# Altium schematic sheet BombasConMUX.SchDoc
size A4
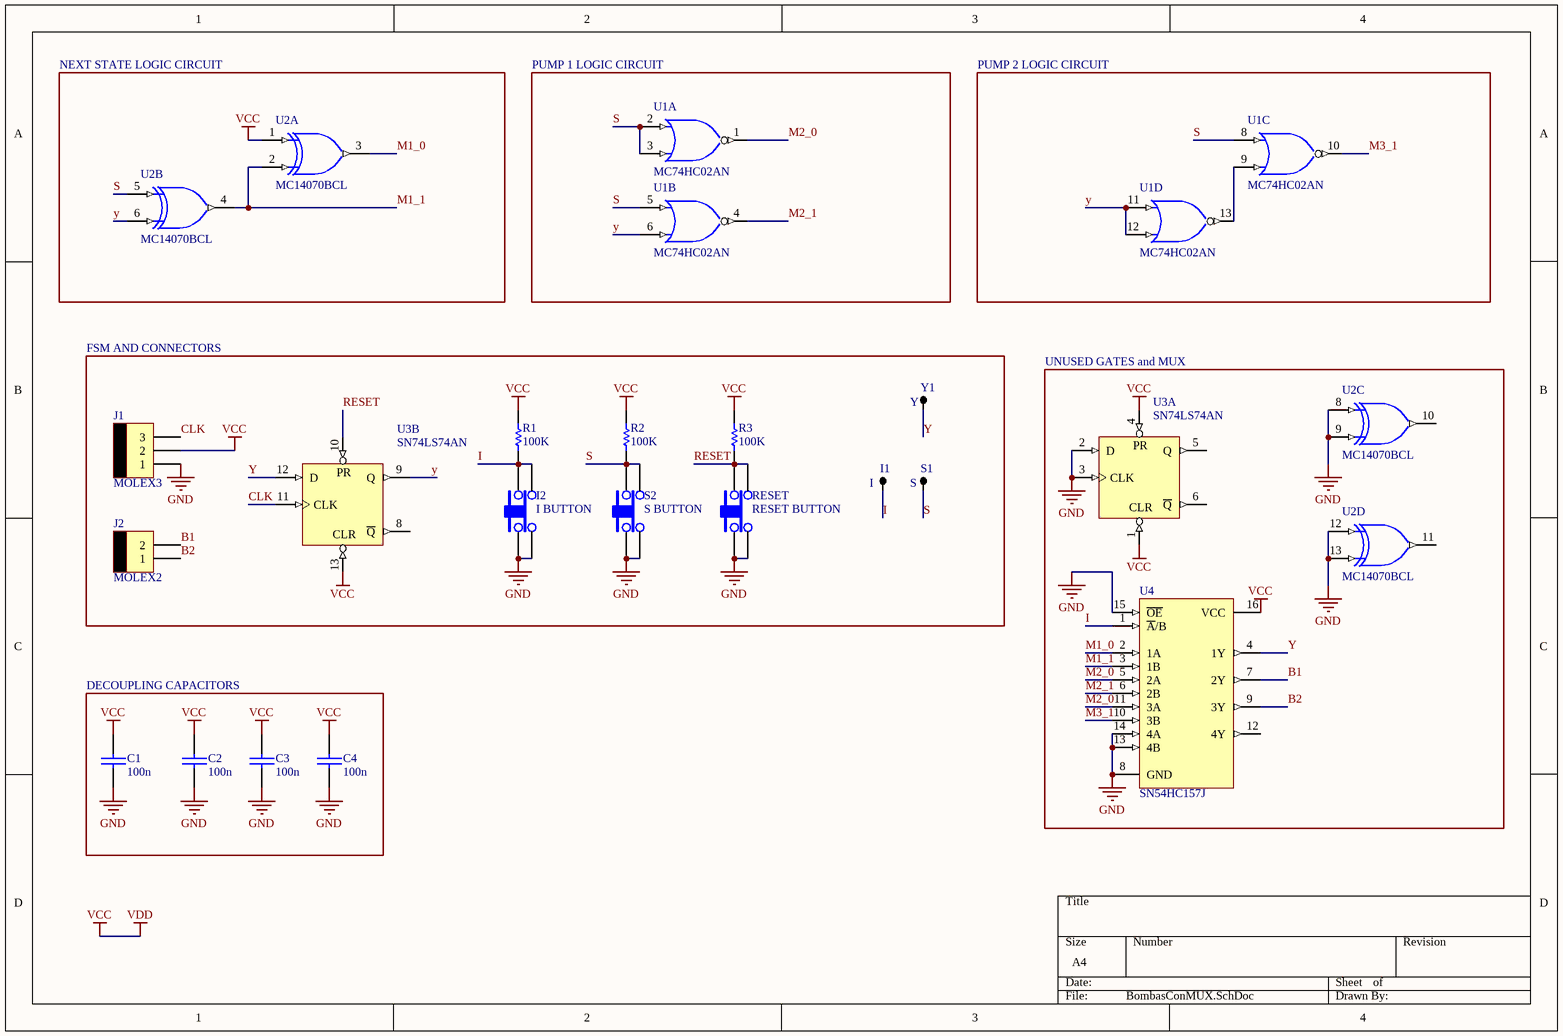
[diagram p0: BombasConMUX.SchDoc]

## Parts
C1  100n  [CAP100]
C2  100n  [CAP100]
C3  100n  [CAP100]
C4  100n  [CAP100]
I1  I  [TPTH]
I2  I BUTTON  [TACTSWITCH]
J1  MOLEX3  [MOLEX3]
J2  MOLEX2  [MOLEX2]
R1  100K  [RES400]
R2  100K  [RES400]
R3  100K  [RES400]
RESET  RESET BUTTON  [TACTSWITCH]
S1  S  [TPTH]
S2  S BUTTON  [TACTSWITCH]
U1  MC74HC02AN  [646-06]  (parts A,B,C,D of 4)
U2  MC14070BCL  [632-08]  (parts A,B,C,D of 4)
U3  SN74LS74AN  [N014D]  (parts A,B of 2)
U4  SN54HC157J  [J016]
Y1  Y  [TPTH]

## Blocks framed on the sheet
NEXT STATE LOGIC CIRCUIT: U2
PUMP 1 LOGIC CIRCUIT: U1
PUMP 2 LOGIC CIRCUIT: U1
FSM AND CONNECTORS: I1 I2 J1 J2 R1-R3 RESET S1 S2 U3 Y1
UNUSED GATES and MUX: U2-U4
DECOUPLING CAPACITORS: C1-C4

## Nets
GND: C1.2 C2.2 C3.2 C4.2 I2.1 I2.2 J1.1 RESET.1 RESET.2 S2.1 S2.2 U1.7(GND) U2.7(GND) U2.8(A) U2.9(B) U2.12(A) U2.13(B) U3.2(D) U3.3(CLK) U3.7(GND) U4.8(GND) U4.13(4B) U4.14(4A) U4.15(~{OE})
VCC: C1.1 C2.1 C3.1 C4.1 J1.2 R1.2 R2.2 R3.2 U1.14(VDD) U2.1(A) U2.14(VDD) U3.1(CLR) U3.4(PR) U3.13(CLR) U3.14(VCC) U4.16(VCC)  [also labelled VDD]
B1: J2.2 U4.7(2Y)
B2: J2.1 U4.9(3Y)
CLK: J1.3 U3.11(CLK)
I: I1.1 I2.3 I2.4 R1.1 U4.1(~{A}/B)
M1_0: U2.3(Y) U4.2(1A)
M1_1: U2.2(B) U2.4(Y) U4.3(1B)
M2_0: U1.1(Y) U4.5(2A) U4.11(3A)
M2_1: U1.4(Y) U4.6(2B)
M3_1: U1.10(Y) U4.10(3B)
RESET: R3.1 RESET.3 RESET.4 U3.10(PR)
S: R2.1 S1.1 S2.3 S2.4 U1.2(A) U1.3(B) U1.5(A) U1.8(A) U2.5(A)
y: U1.6(B) U1.11(A) U1.12(B) U2.6(B) U3.9(Q) U3.12(D) U4.4(1Y) Y1.1
NetU1_9: U1.9(B) U1.13(Y)

Not connected (* = marked no-connect by the designer): U2 10(Y) 11(Y); U3 5(Q) 6(~{Q}) 8(~{Q}); U4 12(4Y)

## Library data of the parts
C1-C4 = CAP
I1 S1 Y1 = TP
I2 RESET S2 = TACT SWITCH: Value: PULSADOR; Footprint: PULSADOR
R1-R3 = RES
U1 = MC74HC02AN: Quad 2-Input NOR Gate; Published: 17-Jul-2002; LatestRevisionDate: 06-Jun-2005; LatestRevisionNote: Stylized 3D Model Added; DatasheetVersion: 1989; PackageVersion: 1997; PackageReference: 646-06; Publisher: Altium Limited; PackageDescription: DIP; 14 Leads; Row Spacing 7.62 mm; Pitch 2.54 mm; ComponentLink1Description: Manufacturer Link; ComponentLink1URL: http://www.onsemi.com/site/products/parametrics/0,4446,247,00.html; ComponentLink2Description: Ibis Model; ComponentLink2URL: http://www.onsemi.com/pub/Collateral/MC54HC02AJ.IBS
U2 = MC14070BCL: Quad XOR Gate; Published: 15-Apr-2002; DatasheetVersion: 1995; PackageVersion: 1995; PackageReference: 632-08; Publisher: Altium Limited; PackageDescription: DIP; 14 Leads; Row Spacing 7.62 mm; Pitch 2.54 mm; ComponentLink1Description: Manufacturer Link; ComponentLink1URL: http://www.onsemi.com/; ComponentLink2Description: Datasheet; ComponentLink2URL: http://www.onsemi.com/pub/Collateral/MC14070B-D.PDF
U3 = SN74LS74AN: Dual D-Type Positive-Edge-Triggered Flip-Flop with Preset and Clear; Value: 74LS74; Footprint: DIP14
U4 = SN54HC157J: Quadraple 2-Line to 1-Line Data Selector/Multiplexer; Published: 8-Jun-2000; LatestRevisionDate: 04-Mar-2005; LatestRevisionNote: Stylized 3D Model Added.; DatasheetVersion: May-1997; PackageVersion: Jun-1999; PackageReference: J016; Publisher: Altium Limited; PackageDescription: DIP; 16 Leads; Row Spacing 7.62 mm; Pitch 2.54 mm; ComponentLink1Description: Manufacturer Link; ComponentLink1URL: http://www.ti.com/; ComponentLink2Description: Datasheet; ComponentLink2URL: http://www-s.ti.com/sc/ds/sn74hc157.pdf